# Altium schematic sheet analog.SchDoc
size A4
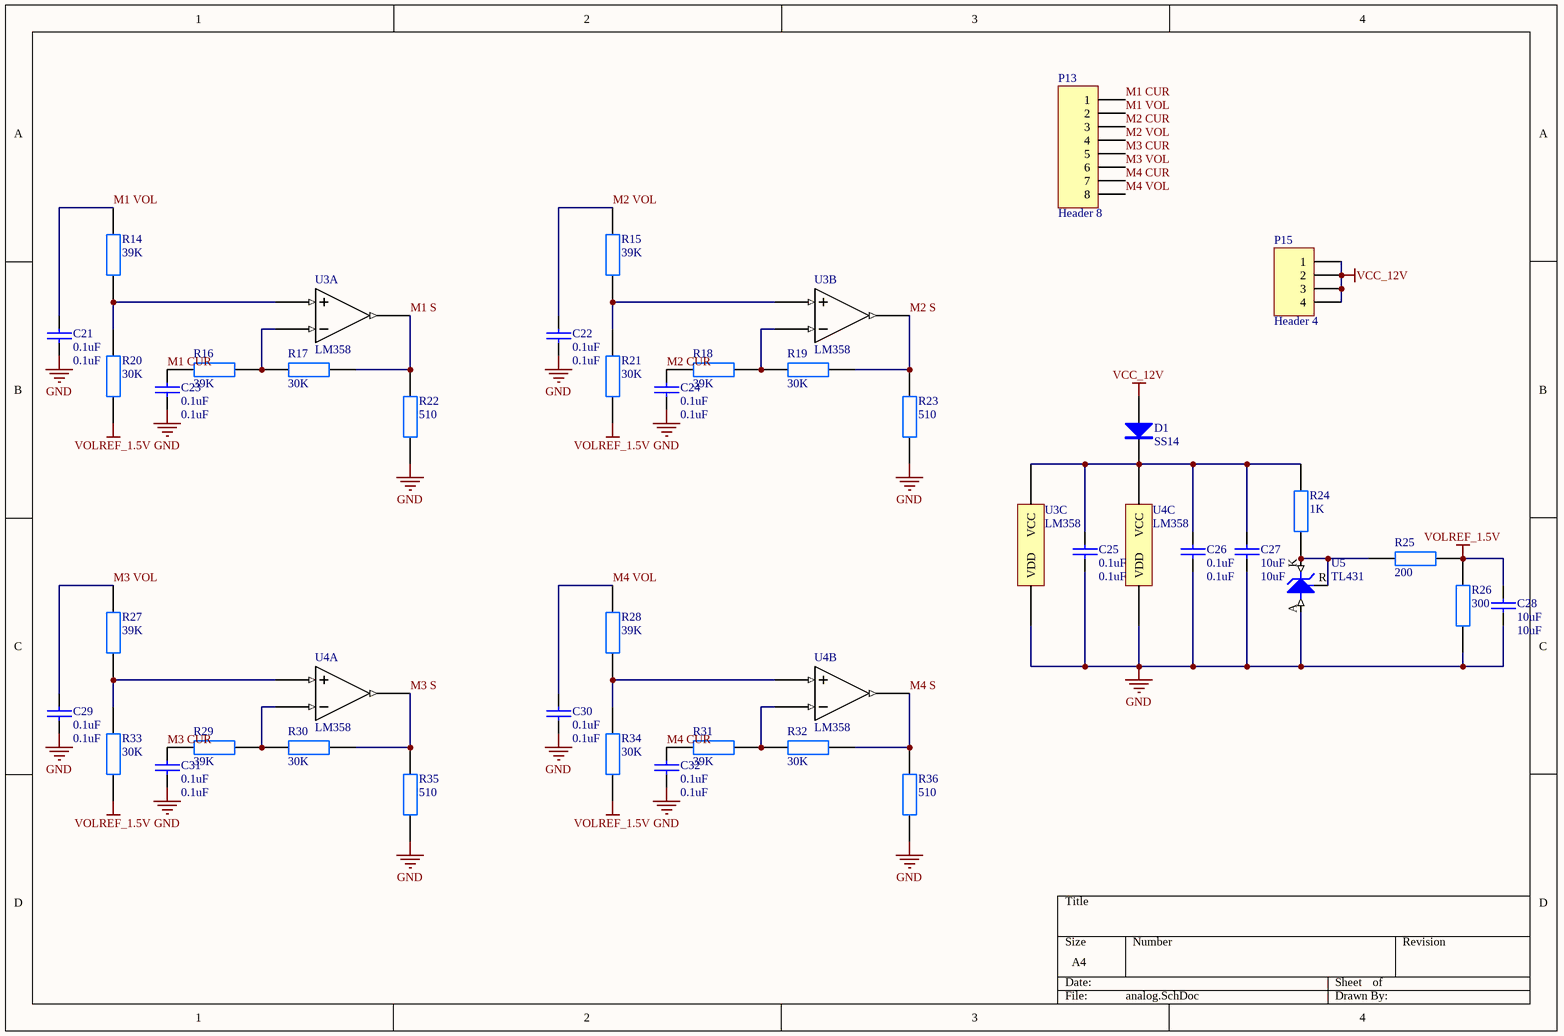
[diagram p0: analog.SchDoc]

## Parts
C21  0.1uF  [0805 CAP]
C22  0.1uF  [0805 CAP]
C23  0.1uF  [0805 CAP]
C24  0.1uF  [0805 CAP]
C25  0.1uF  [0805 CAP]
C26  0.1uF  [0805 CAP]
C27  10uF  [0805 CAP]
C28  10uF  [0805 CAP]
C29  0.1uF  [0805 CAP]
C30  0.1uF  [0805 CAP]
C31  0.1uF  [0805 CAP]
C32  0.1uF  [0805 CAP]
D1  SS14  [DO-241AC]
P13  Header 8  [sip8 i]
P15  Header 4  [sip4 i]
R14  39K  [0805]
R15  39K  [0805]
R16  39K  [0805]
R17  30K  [0805]
R18  39K  [0805]
R19  30K  [0805]
R20  30K  [0805]
R21  30K  [0805]
R22  510  [0805]
R23  510  [0805]
R24  1K  [0805]
R25  200  [0805]
R26  300  [0805]
R27  39K  [0805]
R28  39K  [0805]
R29  39K  [0805]
R30  30K  [0805]
R31  39K  [0805]
R32  30K  [0805]
R33  30K  [0805]
R34  30K  [0805]
R35  510  [0805]
R36  510  [0805]
U3  LM358  [so-8]  (parts A,B,C of 3)
U4  LM358  [so-8]  (parts A,B,C of 3)
U5  TL431  [sot-23]

## Nets
GND: C21.2 C22.2 C23.2 C24.2 C25.2 C26.2 C27.2 C28.2 C29.2 C30.2 C31.2 C32.2 R22.1 R23.1 R26.1 R35.1 R36.1 U3.4(VDD) U4.4(VDD) U5.A
VCC_12V: D1.1(A) P15.1 P15.2 P15.3 P15.4
VOLREF_1.5V: C28.1 R20.1 R21.1 R25.1 R26.2 R33.1 R34.1
M1 CUR: C23.1 P13.1 R16.2
M1 S: R17.1 R22.2 U3.1
M1 VOL: C21.1 P13.2 R14.2
M2 CUR: C24.1 P13.3 R18.2
M2 S: R19.1 R23.2 U3.7
M2 VOL: C22.1 P13.4 R15.2
M3 CUR: C31.1 P13.5 R29.2
M3 S: R30.1 R35.2 U4.1
M3 VOL: C29.1 P13.6 R27.2
M4 CUR: C32.1 P13.7 R31.2
M4 S: R32.1 R36.2 U4.7
M4 VOL: C30.1 P13.8 R28.2
NetC25_1: C25.1 C26.1 C27.1 D1.2(K) R24.2 U3.8(VCC) U4.8(VCC)
NetR14_1: R14.1 R20.2 U3.3
NetR15_1: R15.1 R21.2 U3.5
NetR16_1: R16.1 R17.2 U3.2
NetR18_1: R18.1 R19.2 U3.6
NetR24_1: R24.1 R25.2 U5.K U5.R
NetR27_1: R27.1 R33.2 U4.3
NetR28_1: R28.1 R34.2 U4.5
NetR29_1: R29.1 R30.2 U4.2
NetR31_1: R31.1 R32.2 U4.6

## Library data of the parts
C21-C32 = CAP
  C21-C26 C29-C32: VALUE: 0.1uF
  C27 C28: VALUE: 10uF
D1 = SS14: Diode
P13 = Header 8: Header, 8-Pin; LatestRevisionDate: 17-Jul-2002; LatestRevisionNote: Re-released for DXP Platform.; Publisher: Altium Limited
P15 = Header 4: Header, 4-Pin; LatestRevisionDate: 17-Jul-2002; LatestRevisionNote: Re-released for DXP Platform.; Publisher: Altium Limited
R14-R36 = RES
  R14-R16 R18 R27-R29 R31: VALUE: 39K
  R17 R19-R21 R30 R32-R34: VALUE: 30K
  R22 R23 R35 R36: VALUE: 510
  R24: VALUE: 1K
  R25: VALUE: 200
  R26: VALUE: 300
U5 = TL431: IC; pin to pad: A>3 K>2 R>1